# EAGLE design esp32-poe-thermocouple-hat-prod (EAGLE 7.7.0)
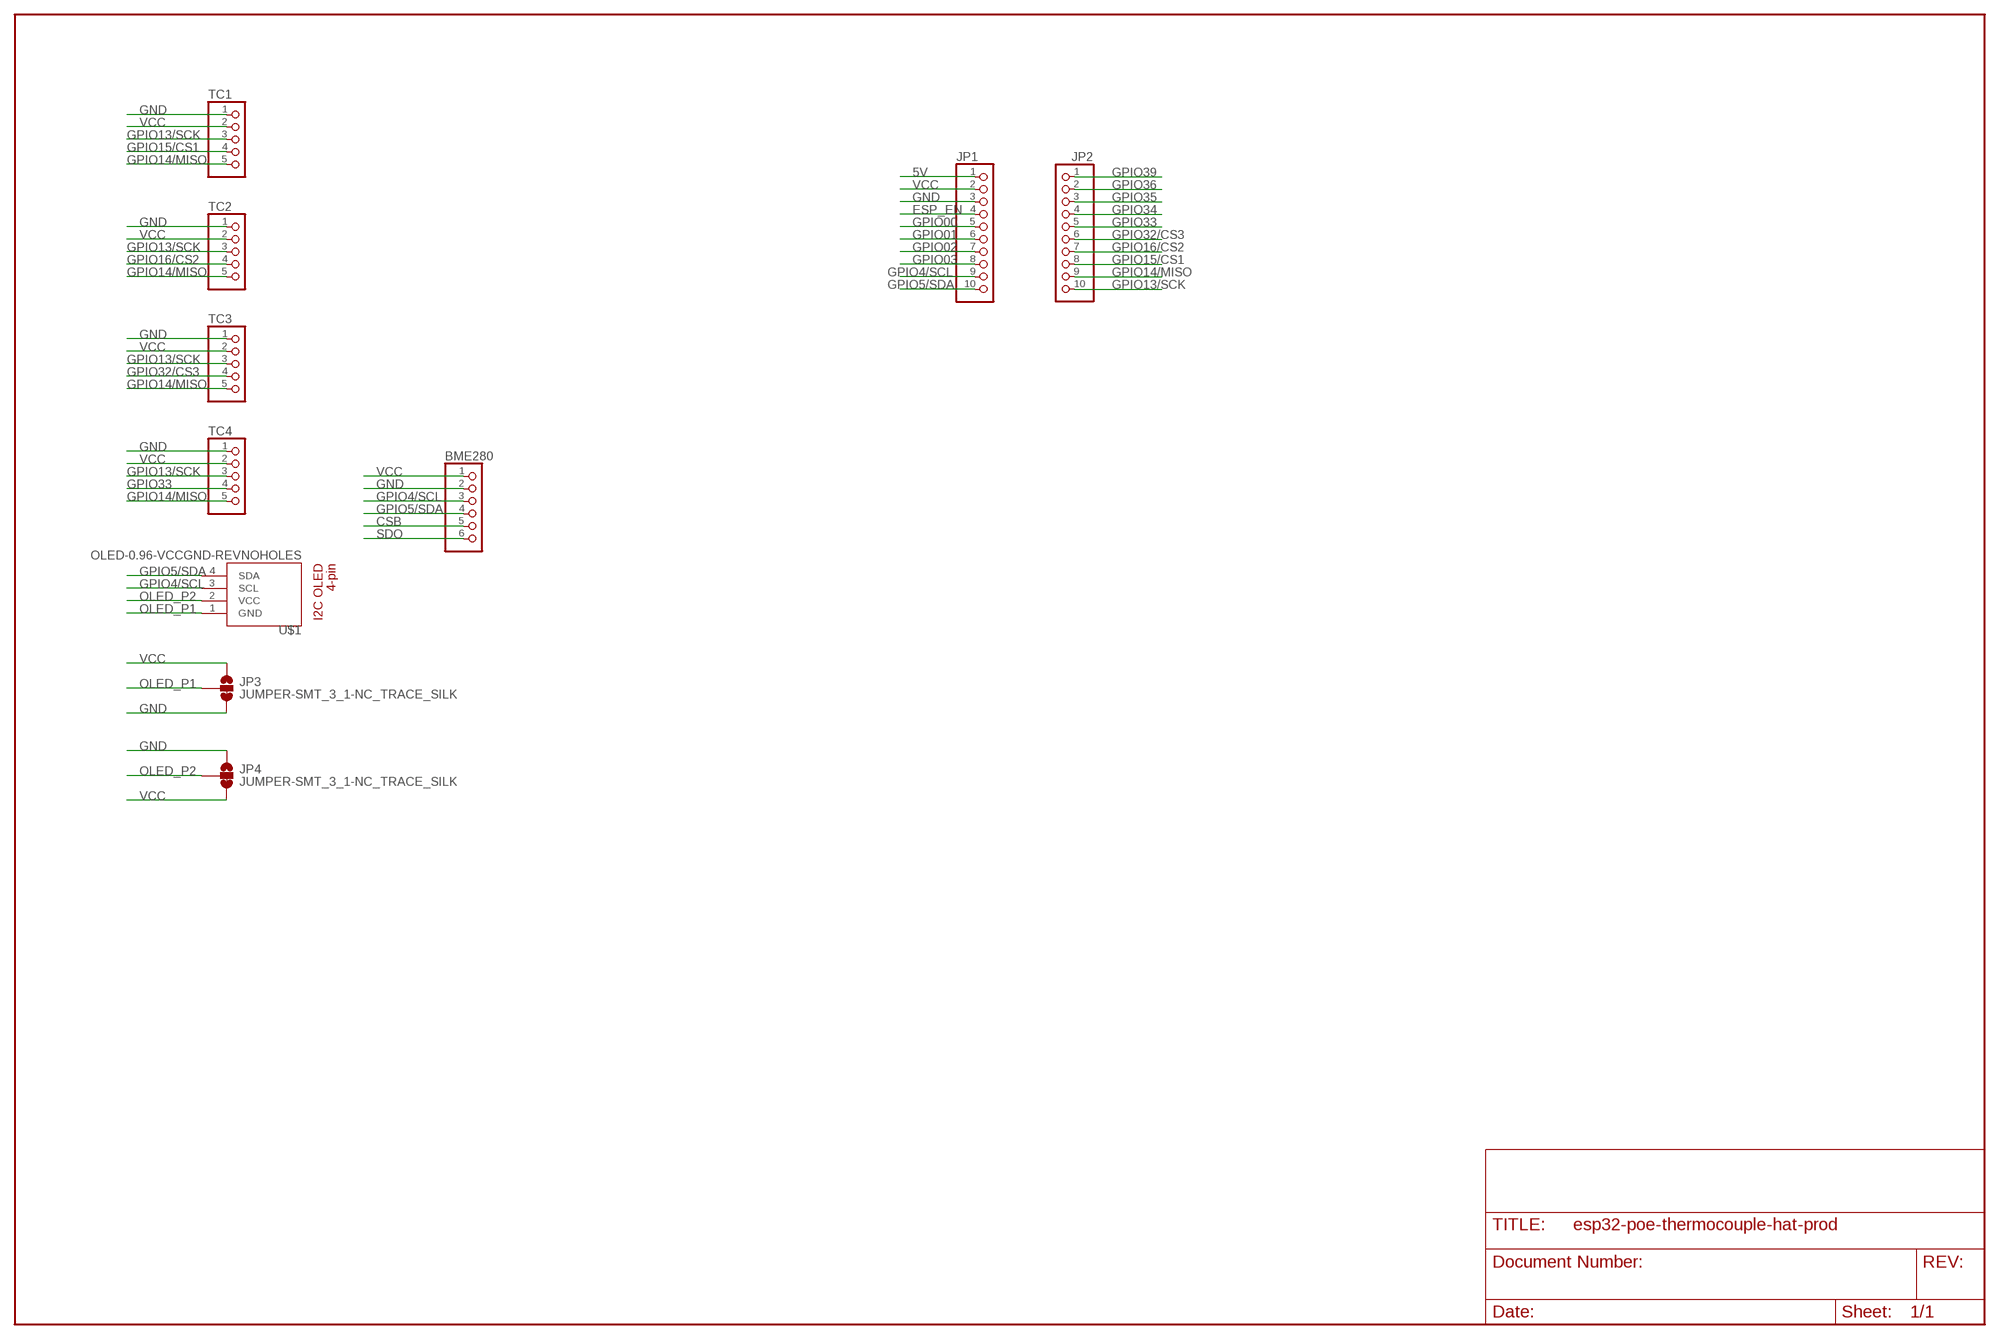
[diagram p0: schematic, sheet 1]

## Parts
BME280  PINHD-1X6  [1X06]
JP1  PINHD-1X10  [1X10]
JP2  PINHD-1X10  [1X10]
JP3  JUMPER-SMT_3_1-NC_TRACE_SILK  [SMT-JUMPER_3_1-NC_TRACE_SILK]
JP4  JUMPER-SMT_3_1-NC_TRACE_SILK  [SMT-JUMPER_3_1-NC_TRACE_SILK]
TC1  PINHD-1X5  [1X05]
TC2  PINHD-1X5  [1X05]
TC3  PINHD-1X5  [1X05]
TC4  PINHD-1X5  [1X05]
U$1  OLED-0.96-VCCGND-REVNOHOLES  [OLED-I2C-4PIN-NOHOLES]

## Nets
5V: JP1.1
CSB: BME280.5
ESP_EN: JP1.4
GND: BME280.2 JP1.3 JP3.3 JP4.1 TC1.1 TC2.1 TC3.1 TC4.1
GPIO00: JP1.5
GPIO01: JP1.6
GPIO02: JP1.7
GPIO03: JP1.8
GPIO4/SCL: BME280.3 JP1.9 U$1.3(SCL)
GPIO5/SDA: BME280.4 JP1.10 U$1.4(SDA)
GPIO13/SCK: JP2.10 TC1.3 TC2.3 TC3.3 TC4.3
GPIO14/MISO: JP2.9 TC1.5 TC2.5 TC3.5 TC4.5
GPIO15/CS1: JP2.8 TC1.4
GPIO16/CS2: JP2.7 TC2.4
GPIO32/CS3: JP2.6 TC3.4
GPIO33: JP2.5 TC4.4
GPIO34: JP2.4
GPIO35: JP2.3
GPIO36: JP2.2
GPIO39: JP2.1
OLED_P1: JP3.2 U$1.1(GND)
OLED_P2: JP4.2 U$1.2(VCC)
SDO: BME280.6
VCC: BME280.1 JP1.2 JP3.1 JP4.3 TC1.2 TC2.2 TC3.2 TC4.2

## Library data of the parts
BME280 = pinhead:PINHD-1X6: PIN HEADER
JP1 JP2 = pinhead:PINHD-1X10: PIN HEADER
JP3 JP4 = SparkFun-Jumpers:JUMPER-SMT_3_1-NC_TRACE: Normally closed trace jumper (1 of 2 connections) This jumper has a trace between two pads so it's normally closed (NC). The other connection is normally open (NO). Use a razor knife to open the connection. For best results follow the IPC guidelines for cutting traces: Cutout at least 0.063 mm (0.005 in). Remove all loose material to clean up the cut area. Seal the cut with an approved epoxy. Reapply solder to reclose the connection, or to close the NO connection.
TC1-TC4 = pinhead:PINHD-1X5: PIN HEADER
U$1 = Warthog9-Screens:OLED-0.96-VCCGND-REV: Common 0.96 OLED screen assembly

## Board
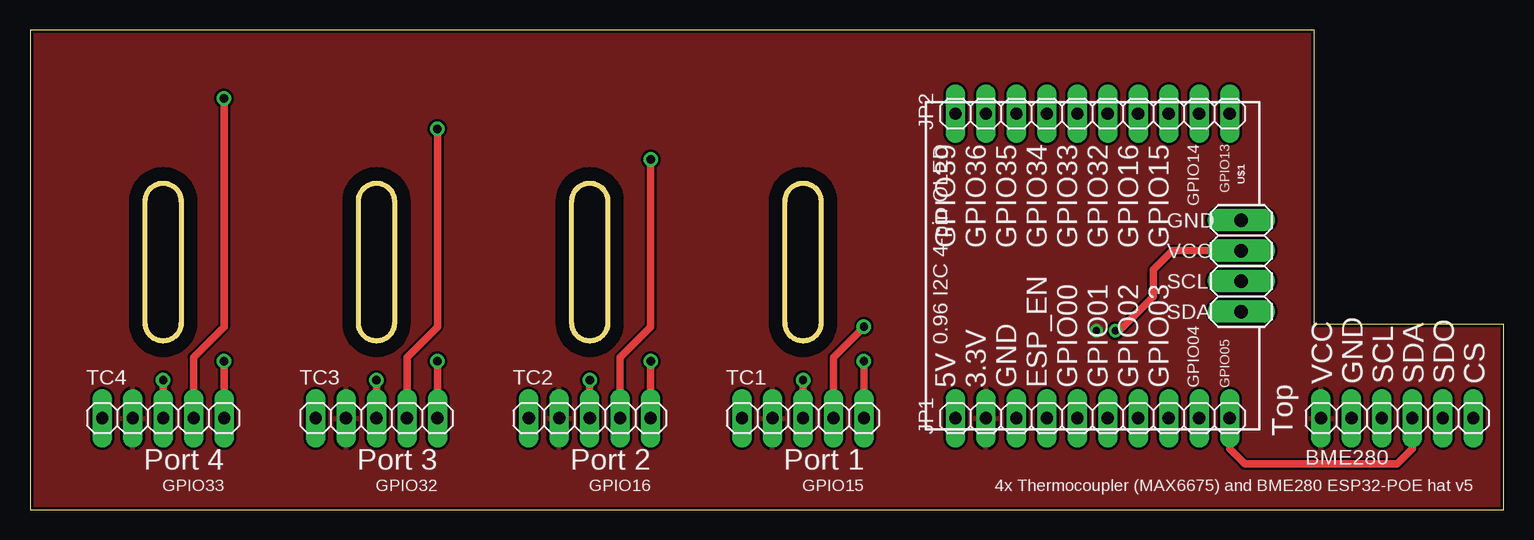
[diagram p1: board, top side]
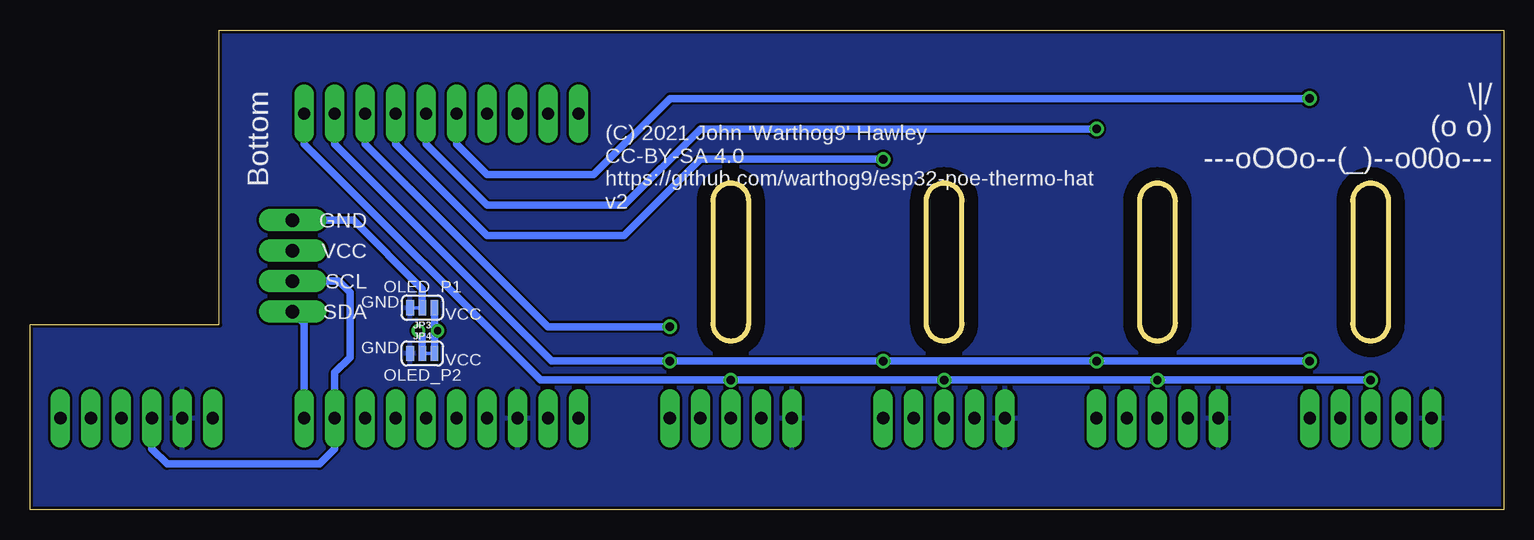
[diagram p2: board, bottom side, seen from below]

Size 122.86 x 40 mm. Coordinates in mm from the lower left corner, seen from the top.
Outline: 122.86,0 122.86,15.43 107.08,15.43 107.08,40 0,40 0,0 122.86,0
Copper layers (1*16): Top 0.035mm / dielectric 1.5mm / Bottom 0.035mm
Design rules "SparkFun *": minimum track width 8mil, minimum drill 20mil, track to track 8mil, track to pad 8mil, pad to pad 8mil, via to via 8mil, smd to smd 8mil, copper to edge 10mil, drill to drill 8mil, minimum pad ring 12mil, minimum via ring 10mil, stop-mask expansion 4mil, vias tented up to drill 25mil, thermal gap 10mil
Milling: area 9.6,14.1 to 12.6,27.2; area 27.4,14.1 to 30.4,27.2; area 45.2,14.1 to 48.2,27.2; area 62.9,14.1 to 65.9,27.2

### Footprints (pad centres in the part's own frame; a part is rotated, then mirrored left to right if it is on the bottom)
1X06 = drill 1.016 long: 1 -6.35,0; 2 -3.81,0; 3 -1.27,0; 4 1.27,0; 5 3.81,0; 6 6.35,0
1X10 = drill 1.016 long: 1 -11.43,0; 2 -8.89,0; 3 -6.35,0; 4 -3.81,0; 5 -1.27,0; 6 1.27,0; 7 3.81,0; 8 6.35,0; 9 8.89,0; 10 11.43,0
SMT-JUMPER_3_1-NC_TRACE_SILK = smd 0.635 x 1.27: 1 -1.016,0; 2 0,0; 3 1.016,0
1X05 = drill 1.016 long: 1 -5.08,0; 2 -2.54,0; 3 0,0; 4 2.54,0; 5 5.08,0
OLED-I2C-4PIN-NOHOLES = drill 1.118 pad 1.88 long: 1 -3.81,12.4; 2 -1.27,12.4; 3 1.27,12.4; 4 3.81,12.4

### Placement (x,y rotation side)
BME280  113.97,7.62 0 top
JP1  88.57,7.62 0 top
JP2  88.57,33.02 0 top
JP3  90.16,16.83 180 bottom
JP4  90.16,13.02 0 bottom
TC1  64.44,7.62 0 top
TC2  46.66,7.62 0 top
TC3  28.88,7.62 0 top
TC4  11.1,7.62 0 top
U$1  88.57,20.32 270 top

### Tracks (layer width: path | path; a pad name or v marks a point on that pad's centre or on a via)
GND
  pour Bottom: -4.14,-7.62 -4.14,46.99 127.94,46.99 127.94,-7.62
GPIO4/SCL
  Bottom 0.61: BME280.3 112.7,5.08 111.43,3.81 98.73,3.81 97.46,5.08 JP1.9 97.46,11.43 96.19,12.7 96.19,18.1 97.14,19.05 U$1.3
GPIO5/SDA
  Top 0.61: JP1.10 100,5.08 101.27,3.81 113.97,3.81 115.24,5.08 BME280.4
  Bottom 0.61: JP1.10 100,15.54 U$1.4
GPIO13/SCK  (via drill 0.7)
  Top 0.61: v64.44,10.79 TC1.3 | v46.66,10.79 TC2.3 | TC3.3 v28.88,10.79 | TC4.3 v11.1,10.79
  Bottom 0.61: JP2.10 100,30.48 80.31,10.79 v64.44,10.79 v46.66,10.79 v28.88,10.79 v11.1,10.79
GPIO14/MISO  (via drill 0.7)
  Top 0.61: TC3.5 v33.96,12.38 | TC2.5 v51.74,12.38 | TC1.5 v69.52,12.38 | TC4.5 v16.18,12.38
  Bottom 0.61: JP2.9 97.46,30.48 79.36,12.38 v69.52,12.38 v51.74,12.38 v33.96,12.38 v16.18,12.38
GPIO15/CS1  (via drill 0.7)
  Top 0.61: v69.52,15.24 66.98,12.7 TC1.4
  Bottom 0.61: JP2.8 94.92,30.48 79.68,15.24 v69.52,15.24
GPIO16/CS2  (via drill 0.7)
  Top 0.61: v51.74,29.21 51.74,15.24 49.2,12.7 TC2.4
  Bottom 0.61: JP2.7 92.38,30.48 84.76,22.86 73.33,22.86 66.98,29.21 v51.74,29.21
GPIO32/CS3  (via drill 0.7)
  Top 0.61: v33.96,31.75 33.96,15.24 31.42,12.7 TC3.4
  Bottom 0.61: JP2.6 89.84,30.48 84.76,25.4 73.33,25.4 66.98,31.75 v33.96,31.75
GPIO33  (via drill 0.7)
  Top 0.61: v16.18,34.29 16.18,15.24 13.64,12.7 TC4.4
  Bottom 0.61: JP2.5 87.3,30.48 84.76,27.94 75.87,27.94 69.52,34.29 v16.18,34.29
N$5
  cutout Top: 8.56,15.56 8.56,25.72 arc-180 13.64,25.72 13.64,15.56 arc-180
  cutout Bottom: 8.56,15.56 8.56,25.72 arc-180 13.64,25.72 13.64,15.56 arc-180
  cutout Bottom: 26.34,15.56 26.34,25.72 arc-180 31.42,25.72 31.42,15.56 arc-180
  cutout Top: 26.34,15.56 26.34,25.72 arc-180 31.42,25.72 31.42,15.56 arc-180
  cutout Top: 44.12,15.56 44.12,25.72 arc-180 49.2,25.72 49.2,15.56 arc-180
  cutout Bottom: 44.12,15.56 44.12,25.72 arc-180 49.2,25.72 49.2,15.56 arc-180
  cutout Bottom: 61.9,15.56 61.9,25.72 arc-180 66.98,25.72 66.98,15.56 arc-180
  cutout Top: 61.9,15.56 61.9,25.72 arc-180 66.98,25.72 66.98,15.56 arc-180
OLED_P1
  Bottom 0.61: U$1.1 95.87,24.13 90.16,18.41 JP3.2
OLED_P2  (via drill 0.6)
  Top 0.61: U$1.2 95.24,21.59 93.65,20 93.65,17.78 90.79,14.92 v90.48,14.92
  Bottom 0.61: JP4.2 90.16,14.61 v90.48,14.92
VCC  (via drill 0.6)
  Bottom 0.61: JP4.3 89.14,14.67 v88.89,14.92 89.14,15.18 JP3.1
  pour Top: -1.6,44.45 -1.6,-5.08 125.4,-5.08 125.4,44.45

### Text on the board
tPlace: GPIO39 | GPIO36 | GPIO35 | GPIO34 | GPIO33 | GPIO32 | GPIO16 | GPIO15 | GPIO14 | GPIO13 | 5V | 3.3V | GND | ESP_EN | GPIO00 | GPIO01 | GPIO02 | GPIO03 | GPIO04 | GPIO05 | Top | VCC | GND | SCL | SDA | SDO | CS | Port 4 | Port 3 | Port 2 | Port 1 | GPIO33 | GPIO32 | GPIO16 | GPIO15 | 4x Thermocoupler (MAX6675) and BME280 ESP32-POE hat v5
bPlace: \\|/ / (o o) / ---oOOo--(_)--o00o--- | Bottom | (C) 2021 John 'Warthog9' Hawley / CC-BY-SA 4.0 / https://github.com/warthog9/esp32-poe-thermo-hat / v2 | OLED_P1 | VCC | GND | VCC | GND | OLED_P2
tStop: ::/-1 - Invalid.Network